# Altium schematic sheet CaRe_Schematic_GARMENT_CONNECTOR.SchDoc
size B
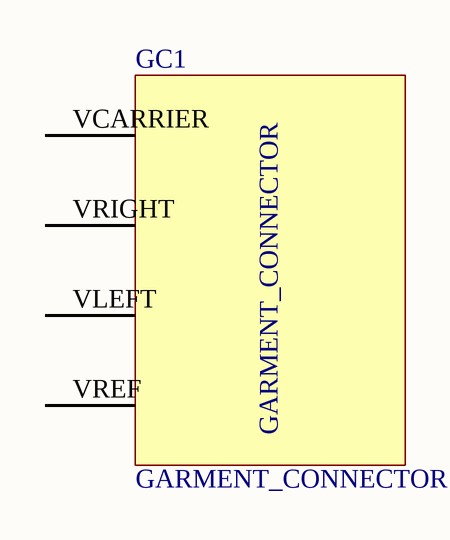
[diagram p0: CaRe_Schematic_GARMENT_CONNECTOR.SchDoc]

## Parts
GC1  GARMENT_CONNECTOR  [GARMENT_DIN]

## Nets

Not connected (* = marked no-connect by the designer): GC1 VCARRIER VLEFT VREF VRIGHT